# EasyEDA Pro project TF_MUX.epro, schematic TF_MUX v0.0.5-RC1
Board Name: TF_MUX; Create Date: 2025-04-12; Page Name: main; Project Name: sd_mux; Schematic Name: TF_MUX v0.0.5-RC1; Update Date: 2025-04-29; Company: @Rath @LingWang; Drawed: LingWang; Page Size: A4; Reviewed: Rath; Version: V0.0.5-RC1
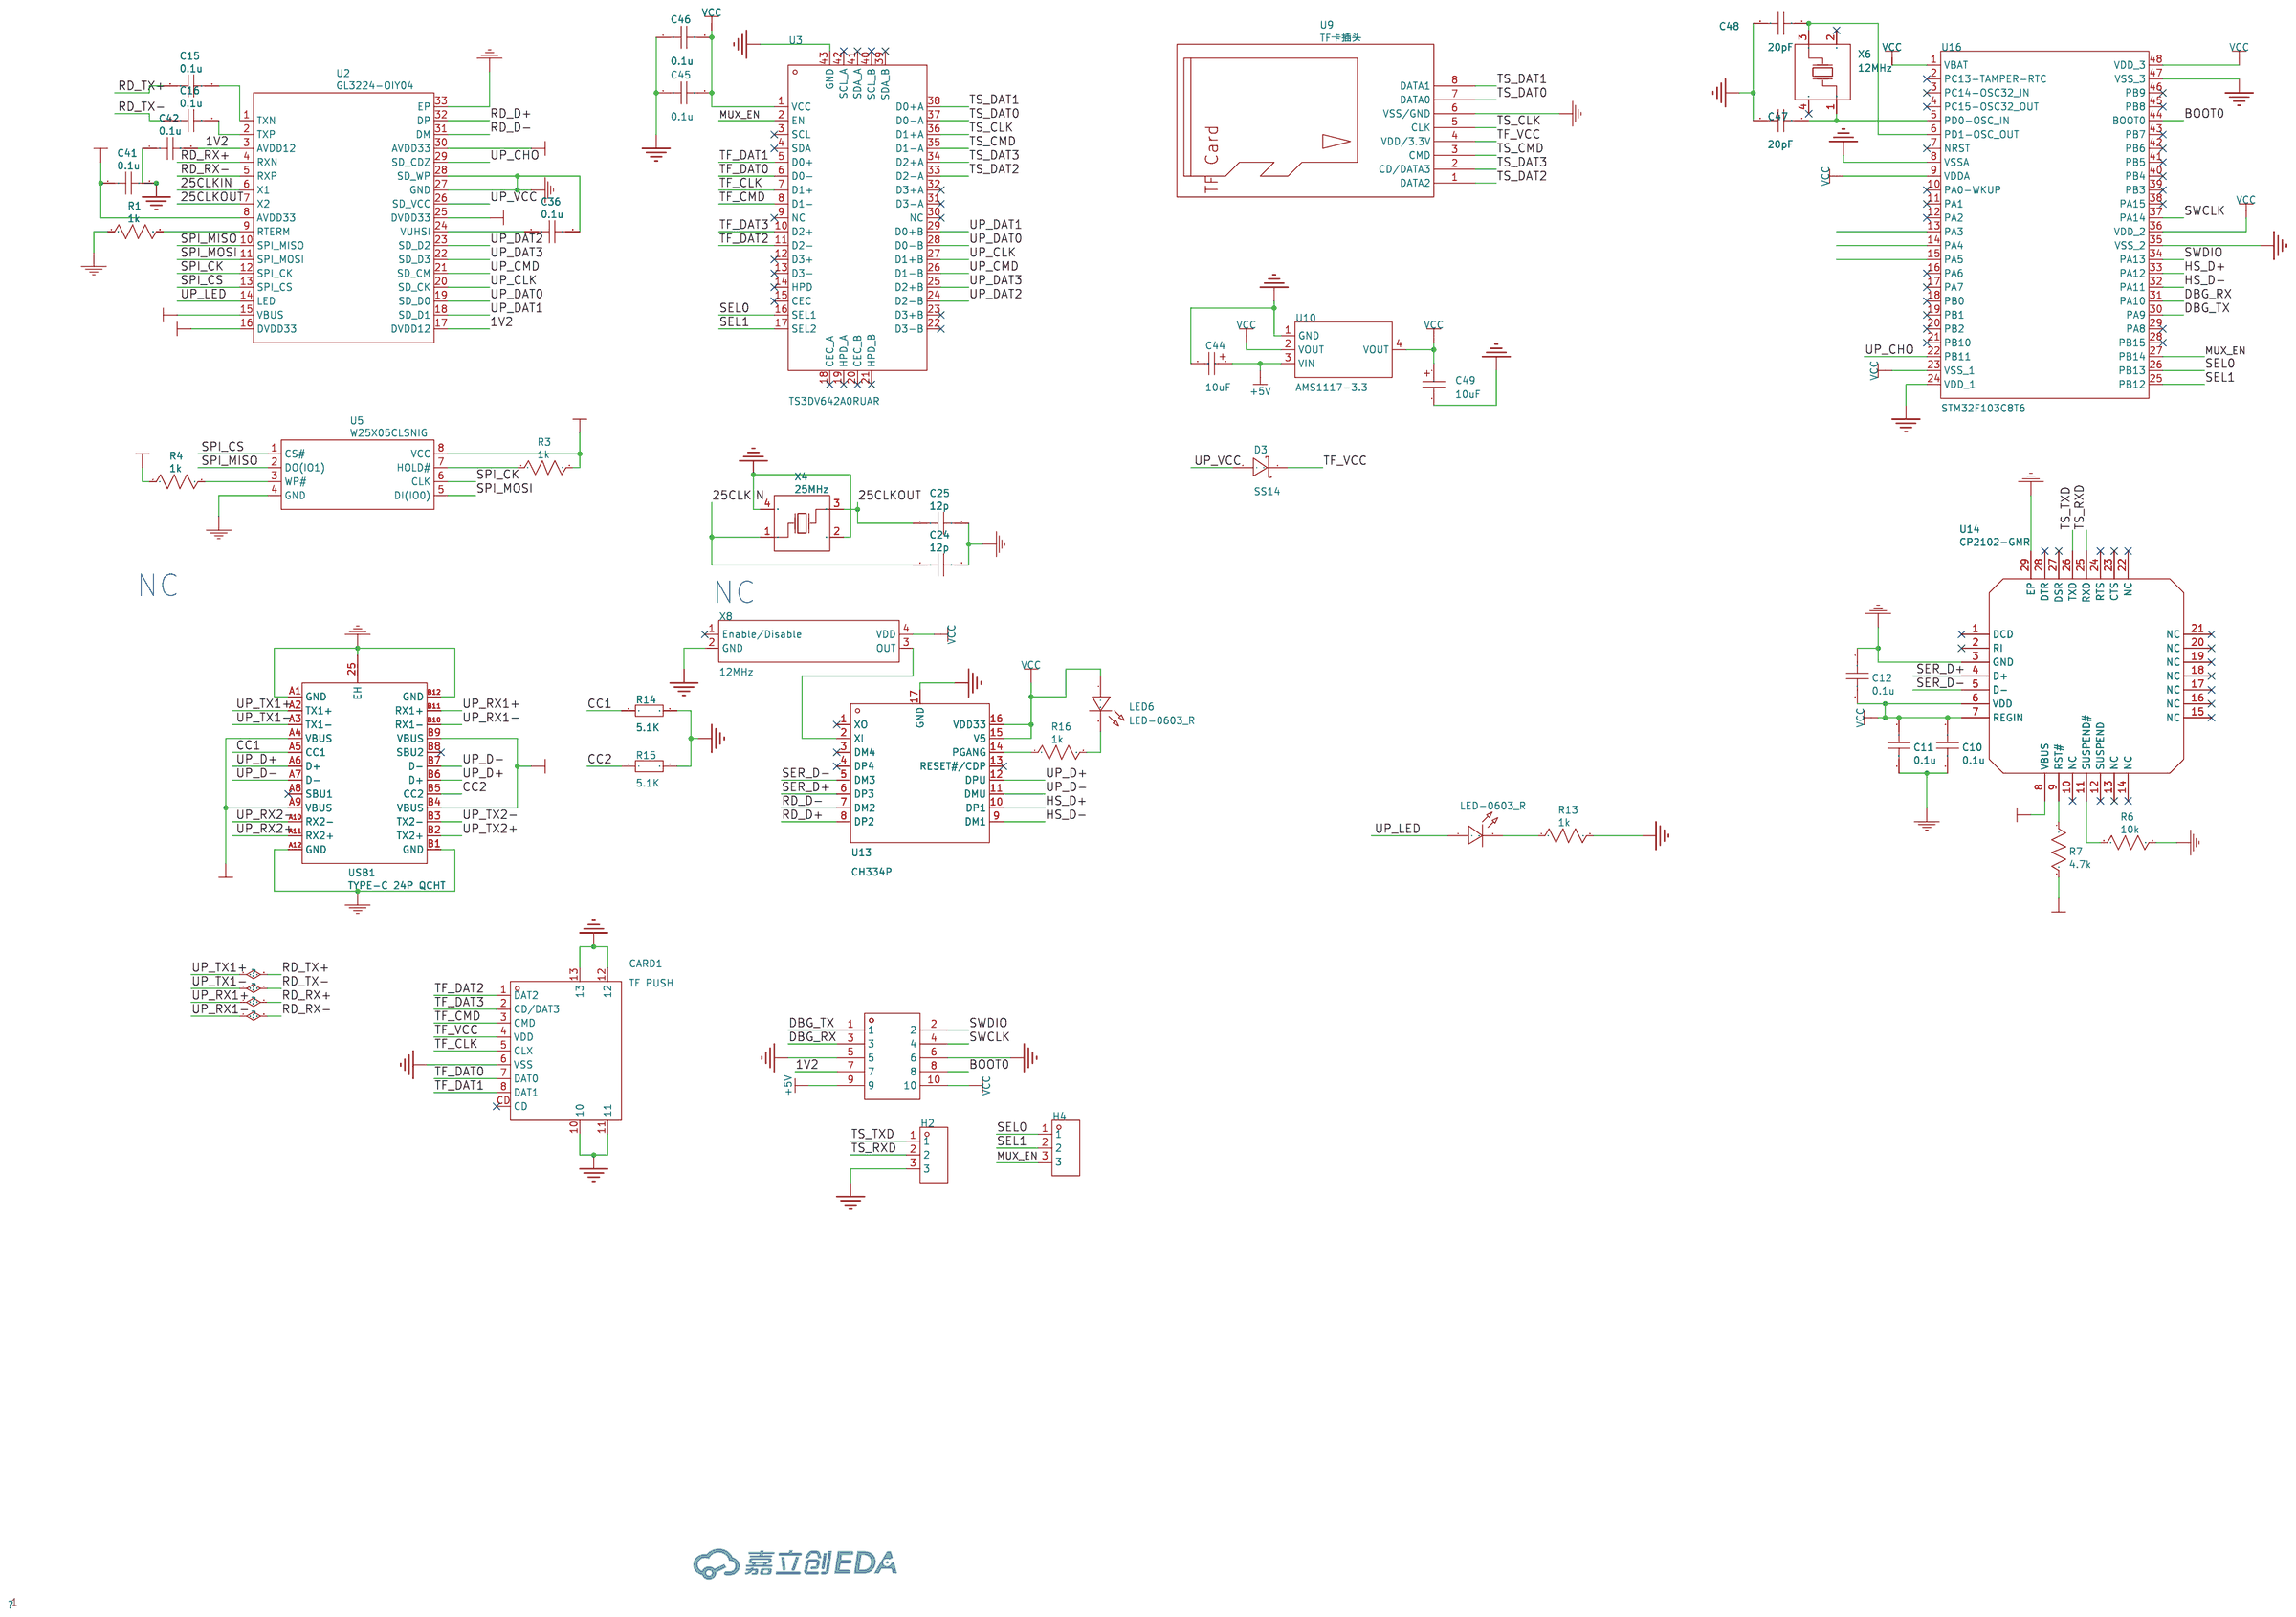
[diagram p0: schematic sheet]

## Parts
C10  0.1u  [C0402]  (no BOM)
C11  0.1u  [C0402]  (no BOM)
C12  0.1u  [C0402]  (no BOM)
C15  0.1u  [C0402]
C16  0.1u  [C0402]
C24  12p  [C0603]  (no BOM)
C25  12p  [C0603]  (no BOM)
C36  0.1u  [C0402]
C41  0.1u  [C0402]
C42  0.1u  [C0402]
C44  10uF  [CAP-SMD_L3.2-W1.6-RD-C7171]
C45  0.1u  [C0402]
C46  0.1u  [C0402]
C47  20pF  [C0402]
C48  20pF  [C0402]
C49  10uF  [CAP-SMD_L3.2-W1.6-RD-C7171]
CARD1  TF PUSH  [TF-SMD_TF-PUSH]
D3  SS14  [SMA_L4.2-W2.6-LS5.3-RD]
H2  -  [HDR-TH_3P-P2.54-V-M]
H3  -  [HDR-TH_10P-P2.54-V-M-R2-C5-S2.54]
H4  -  [HDR-TH_3P-P2.54-V-M]
LED5  LED-0603_R  [LED0603_RED]
LED6  LED-0603_R  [LED0603_RED]
R1  1k  [R0603]
R3  1k  [R0603]  (no BOM)
R4  1k  [R0603]  (no BOM)
R6  10k  [R0603]  (no BOM)
R7  4.7k  [R0603]  (no BOM)
R13  1k  [R0603]
R14  5.1K  [R0603]
R15  5.1K  [R0603]
R16  1k  [R0603]
U2  GL3224-OIY04  [HQFN-32_L5.0-W5.0-P0.50-BL-EP3.0]
U3  TS3DV642A0RUAR  [WFQFN-42_L9.0-W3.5-P0.50-BL-EP]
U5  W25X05CLSNIG  [SOIC-8_L4.9-W3.9-P1.27-LS6.0-BL]  (no BOM)
U9  TF卡插头  [TF卡封装]  (no BOM)
U10  AMS1117-3.3  [SOT-223-3_L6.5-W3.4-P2.30-LS7.0-BR]
U13  CH334P  [QFN-16_L3.0-W3.0-P0.50-BL-EP1.7]
U14  CP2102-GMR  [WQFN-28_L5.0-W5.0-P0.50-BL-EP3.2]  (no BOM)
U16  STM32F103C8T6  [LQFP-48_L7.0-W7.0-P0.50-LS9.0-BL]
USB1  TYPE-C 24P QCHT  [TYPE-C-SMD_TYPE-C-24P-QCHT]
X4  25MHz  [CRYSTAL-SMD_4P-L3.2-W2.5-BL]  (no BOM)
X6  12MHz  [CRYSTAL-SMD_4P-L3.2-W2.5-BL]
X8  12MHz  [OSC-SMD_4P-L2.0-W1.6-BL]  (no BOM)

## Library data of the parts
C10-C12 C15 C16 C36 C41 C42 C45 C46 = 0.1u
C24 C25 = 12p
C44 C49 = TAJA106K016RNJ: 容值:10uF;精度:±10%;额定电压:16V;等效串联电阻:3Ω@100kHz;; LCSC Part Name: 10uF ±10% 16V; Supplier Part: C7171; Manufacturer: Kyocera AVX; Supplier Footprint: CASE-A-3216; JLCPCB Part Class: 基础库; Datasheet: https://atta.szlcsc.com/upload/public/pdf/source/20160107/1457707750344.pdf; Supplier: LCSC; Tolerance: ±10%; Rated Voltage: 16V; Equivalent Series Resistance(ESR): 3Ω@100kHz; Operating Temperature: -55℃~+125℃
C47 C48 = CAP_0402: Supplier Footprint: 0402
CARD1 = TF PUSH: 卡连接方式:自弹式;卡类型:MicroSD卡(TF卡);连接器类型:卡座;本体最大高度:2mm;工作温度范围:-20℃~+90℃;; LCSC Part Name: 自弹式 MicroSD卡(TF卡) 卡座; Supplier Part: C393941; Manufacturer: SHOU HAN(首韩); Supplier Footprint: SMD; JLCPCB Part Class: 扩展库; Datasheet: https://atta.szlcsc.com/upload/public/pdf/source/20191011/C393941_0DDD896EE907FEB750D8B7B8982E2A67.pdf; Supplier: LCSC; Card Connection Mode: 自弹式; Card Type: MicroSD卡(TF卡); Connector Type: 卡座; Additional Card Detection Pins: 无; Maximum Body Height: 2mm; Operating Temperature Range: -20℃~+90℃
D3 = SS14_C2480: 二极管配置:独立式;正向压降(Vf):550mV@1A;直流反向耐压(Vr):40V;整流电流:1A;; LCSC Part Name: 电压:40V 电流:1A; Supplier Part: C2480; Manufacturer: MDD(辰达半导体); Supplier Footprint: SMA(DO-214AC); JLCPCB Part Class: 基础库; Datasheet: https://atta.szlcsc.com/upload/public/pdf/source/20240710/EF24798823EE33D63F154ED67BAC5E71.pdf; Supplier: LCSC; Diode Configuration: 独立式; Forward Voltage (Vf@If): 550mV@1A; Reverse Voltage (Vr): 40V; Rectified Current: 1A; Reverse Leakage Current (Ir): 300uA@40V
H2 H4 = HDR-M_2.54_1x3P: Supplier Part: C2937625; Supplier Footprint: 插件
H3 = HDR-M_2.54_2x5: Supplier Part: C124387; Supplier Footprint: 插件,P=2.54mm
LED5 LED6 = LED-0603_R: Manufacturer: EVERLIGHT(台湾亿光); Manufacturer Part: 19-217/R6C-AL1M2VY/3T; Supplier Part: C72044; Supplier: LCSC
R1 R3 R4 R13 R16 = 1k
R6 = 10k
R7 = 4.7k
R14 R15 = Res_0603: Supplier Footprint: 0603
U2 = GL3224-OIY04: Supplier: LCSC; Supplier Part: C157357; Manufacturer: GENESYS(创惟); JLCPCB Part Class: Extended Part
U3 = TS3DV642A0RUAR: 开关电路:单刀双掷(SPDT);通道数:12;导通电阻(Ron@VCC):9.5Ω;; LCSC Part Name: 具有1.8V兼容控制和断电模式的12通道1:2多路复用器/多路解复用器; Supplier Part: C157482; Manufacturer: TI(德州仪器); Supplier Footprint: WFQFN-42-EP(3.5x9); JLCPCB Part Class: 扩展库; Datasheet: https://www.ti.com/cn/lit/gpn/ts3dv642; Supplier: LCSC; Switch Circuit: 单刀双掷(SPDT); Number of Channels: 12; Supply Voltage: 2.6V~4.5V; Turn-on time: 100ns; On-State Resistance (Max): 9.5Ω; Operating Temperature: -40℃~+85℃
U5 = W25X05CLSNIG: Supplier: LCSC; Supplier Part: C2641187; Manufacturer: WINBOND(华邦); JLCPCB Part Class: Extended Part
U9 = TF卡插头: Supplier: HeZo
U10 = AMS1117-3.3_C6186: 输出类型:固定;工作电压:-;输出电压:3.3V;输出电流:1A;电源纹波抑制比(PSRR):72dB@(120Hz);输出极性:正极;; LCSC Part Name: 输出3.3V 1A; Supplier Part: C6186; Manufacturer: AMS; Supplier Footprint: SOT-223; JLCPCB Part Class: 基础库; Datasheet: https://atta.szlcsc.com/upload/public/pdf/source/20180727/C6186_7A095716F0823C02F1997A905E26C086.pdf; Supplier: LCSC; Output Type: 固定; Output Voltage: 3.3V; Output Current: 1A; Power Supply Rejection Ratio (PSRR): 72dB@(120Hz); Voltage Dropout: 1.3V@(800mA); Features: 过流保护(OCP)；热关断(TSD); Output Configuration: 正极; Number of Outputs: 1
U13 = CH334P: CH334和CH335是符合USB2.0协议规范的4端口USBHUB控制器芯片，上行端口支持USB2.0高速和全速，下行端口支持USB2.0高速480Mbps、全速12Mbps和低速1.5Mbps。; Supplier Part: C5373042; Manufacturer: WCH(南京沁恒); Supplier Footprint: QFN-16(3x3); JLCPCB Part Class: 扩展库; Datasheet: https://atta.szlcsc.com/upload/public/pdf/source/20230505/F9D05933C283E82A0686C9413889129E.pdf; Supplier: LCSC; type: 集线器; Protocol: USB 2.0; Data Rate: 480Mbps; Supply Voltage: 3.3V; Operating Temperature: -40℃~+85℃
U14 = CP2102-GMR: Supplier: LCSC; Manufacturer: SKYWORKS/SILICON LABS(芯科); Supplier Part: C6568; JLCPCB Part Class: Extended Part
U16 = STM32F103C8T6: CPU内核:ARM-M3;CPU最大主频:72MHz;应用领域:-;; LCSC Part Name: 主流增强型ARM Cortex-M3 MCU，具有64 KB Flash、72 MHz CPU、电机控制、USB和CAN; Supplier Part: C8734; Manufacturer: ST(意法半导体); Supplier Footprint: LQFP-48(7x7); JLCPCB Part Class: 扩展库; Datasheet: https://atta.szlcsc.com/upload/public/pdf/source/20220812/8363ACEC51AD55ECEB84799464F7CB85.pdf; Supplier: LCSC; CPU Core: ARM-M3; CPU Maximum Speed: 72MHz; Program Storage Size: 64KB; Program Memory Type: FLASH; Number of I/O: 37; ADC (Bit): 12bit; Low Voltage Detection Threshold: 2V~3.6V
USB1 = TYPE-C 24P QCHT: Supplier: LCSC; Supplier Part: C456013; Manufacturer: SHOU HAN(首韩); JLCPCB Part Class: Extended Part
X4 = 25MHz: Supplier: LCSC; Manufacturer: YXC(扬兴晶振); Manufacturer Part: X322525MOB4SI; Supplier Part: C9006; JLCPCB Part Class: Basic Part
X6 = X322512MSB4SI: 晶振类型:贴片晶振;频率:12MHz;常温频差:±10ppm;外接负载电容:20pF;频率稳定度(全温):±20ppm;; LCSC Part Name: 12MHz ±10ppm 20pF; Supplier Part: C9002; Manufacturer: YXC(扬兴晶振); Supplier Footprint: SMD3225-4P; JLCPCB Part Class: 基础库; Datasheet: https://atta.szlcsc.com/upload/public/pdf/source/20240329/19D5F850207469550BEB00D7DFEDBC7A.pdf; Supplier: LCSC; Crystal Type: 贴片晶振; Normal temperature Frequency Tolerance: ±10ppm; External load capacitor: 20pF; Frequency Stability(Full temperature range): ±20ppm; Operating Temperature: -40℃~+85℃
X8 = OT201612MJBA4SL: 频率:12MHz;常温频差:±10ppm;输出模式:CMOS;工作电压:1.8V~3.3V;工作电流:4mA;频率稳定度:±20ppm;; LCSC Part Name: 12MHz ±10ppm 1.8V~3.3V YSO110TR; Supplier Part: C669076; Manufacturer: YXC(扬兴晶振); Supplier Footprint: SMD2016-4P; JLCPCB Part Class: 扩展库; Datasheet: https://atta.szlcsc.com/upload/public/pdf/source/20240731/596E5F7673E50DA744B7F79F139FB8DF.pdf; Supplier: LCSC; Normal temperature Frequency Tolerance: ±10ppm; Output Type: CMOS; Voltage - Supply: 1.8V~3.3V; Current - Supply: 4mA; Frequency Stability: ±20ppm; Operating Temperature: -40℃~+85℃

## Nets
1V2: C42.2 H3.7 U2.3(AVDD12) U2.17(DVDD12)
+5V: C44.1 H3.9 U2.15(VBUS) U10.3(VIN) U14.8(VBUS) USB1.A4(VBUS) USB1.A9(VBUS) USB1.B4(VBUS) USB1.B9(VBUS)
GND: C10.2 C11.2 C12.1 C24.2 C25.2 C36.2 C41.2 C42.1 C44.2 C45.1 C46.1 C47.2 C48.2 C49.2 CARD1.6(VSS) CARD1.10 CARD1.11 CARD1.12 CARD1.13 H2.3 H3.5 H3.6 R1.1 R6.1 R13.2 R14.2 R15.2 U2.27(GND) U2.28(SD_WP) U2.33(EP) U3.43(GND) U5.4(GND) U9.6(VSS/GND) U10.1(GND) U13.17(GND) U14.3(GND) U14.29(EP) U16.8(VSSA) U16.24(VDD_1) U16.35(VSS_2) U16.47(VSS_3) USB1.25(EH) USB1.A1(GND) USB1.A12(GND) USB1.B1(GND) USB1.B12(GND) X4.2(GND) X4.4(GND) X8.2(GND)
VCC: C10.1 C11.1 C12.2 C41.1 C45.2 C46.2 C49.1 H3.10 LED6.1 R3.2 R4.1 R7.2 U2.8(AVDD33) U2.16(DVDD33) U2.25(DVDD33) U2.30(AVDD33) U3.1(VCC) U5.8(VCC) U10.2(VOUT) U10.4(VOUT) U13.15(V5) U13.16(VDD33) U14.6(VDD) U14.7(REGIN) U16.1(VBAT) U16.9(VDDA) U16.23(VSS_1) U16.36(VDD_2) U16.48(VDD_3) X8.4(VDD)
25CLKIN: C24.1 U2.6(X1) X4.1(OSC1)
25CLKOUT: C25.1 U2.7(X2) X4.3(OSC2)
BOOT0: H3.8 U16.44(BOOT0)
CC1: R14.1 USB1.A5(CC1)
CC2: R15.1 USB1.B5(CC2)
DBG_RX: H3.3 U16.31(PA10)
DBG_TX: H3.1 U16.30(PA9)
HS_D+: U13.10(DP1) U16.33(PA12)
HS_D-: U13.9(DM1) U16.32(PA11)
MUX_EN: H4.3 U3.2(EN) U16.27(PB14)
RD_D+: U2.32(DP) U13.8(DP2)
RD_D-: U2.31(DM) U13.7(DM2)
RD_RX+: U2.4(RXN) USB1.B11(RX1+)
RD_RX-: U2.5(RXP) USB1.B10(RX1-)
RD_TX+: C15.1 USB1.A2(TX1+)
RD_TX-: C16.1 USB1.A3(TX1-)
SEL0: H4.1 U3.16(SEL1) U16.26(PB13)
SEL1: H4.2 U3.17(SEL2) U16.25(PB12)
SER_D+: U13.6(DP3) U14.4(D+)
SER_D-: U13.5(DM3) U14.5(D-)
SPI_CK: U2.12(SPI_CK) U5.6(CLK)
SPI_CS: U2.13(SPI_CS) U5.1(CS#)
SPI_MISO: U2.10(SPI_MISO) U5.2(DO(IO1))
SPI_MOSI: U2.11(SPI_MOSI) U5.5(DI(IO0))
SWCLK: H3.4 U16.37(PA14)
SWDIO: H3.2 U16.34(PA13)
TF_CLK: CARD1.5(CLX) U3.7(D1+)
TF_CMD: CARD1.3(CMD) U3.8(D1-)
TF_DAT0: CARD1.7(DAT0) U3.6(D0-)
TF_DAT1: CARD1.8(DAT1) U3.5(D0+)
TF_DAT2: CARD1.1(DAT2) U3.11(D2-)
TF_DAT3: CARD1.2(CD/DAT3) U3.10(D2+)
TF_VCC: CARD1.4(VDD) D3.1(K) U9.4(VDD/3.3V)
TS_CLK: U3.36(D1+A) U9.5(CLK)
TS_CMD: U3.35(D1-A) U9.3(CMD)
TS_DAT0: U3.37(D0-A) U9.7(DATA0)
TS_DAT1: U3.38(D0+A) U9.8(DATA1)
TS_DAT2: U3.33(D2-A) U9.1(DATA2)
TS_DAT3: U3.34(D2+A) U9.2(CD/DATA3)
TS_RXD: H2.2 U14.25(RXD)
TS_TXD: H2.1 U14.26(TXD)
UP_CHO: U2.29(SD_CDZ) U16.22(PB11)
UP_CLK: U2.20(SD_CK) U3.27(D1+B)
UP_CMD: U2.21(SD_CM) U3.26(D1-B)
UP_D+: U13.12(DPU) USB1.A6(D+) USB1.B6(D+)
UP_D-: U13.11(DMU) USB1.A7(D-) USB1.B7(D-)
UP_DAT0: U2.19(SD_D0) U3.28(D0-B)
UP_DAT1: U2.18(SD_D1) U3.29(D0+B)
UP_DAT2: U2.23(SD_D2) U3.24(D2-B)
UP_DAT3: U2.22(SD_D3) U3.25(D2+B)
UP_LED: LED5.1 U2.14(LED)
UP_RX2+: USB1.A11(RX2+)
UP_RX2-: USB1.A10(RX2-)
UP_TX2+: USB1.B2(TX2+)
UP_TX2-: USB1.B3(TX2-)
UP_VCC: D3.2(A) U2.26(SD_VCC)
$1N442: R1.2 U2.9(RTERM)
$1N465: C16.2 U2.2(TXP)
$1N466: C15.2 U2.1(TXN)
$1N469: C36.1 U2.24(VUHSI)
$1N1150: LED5.2 R13.1
$1N2251: R3.1 U5.7(HOLD#)
$1N2254: R4.2 U5.3(WP#)
$1N4322: U13.2(XI) X8.3(OUT)
$1N4433: LED6.2 R16.2
$1N4439: R16.1 U13.14(PGANG)
$1N5720: R6.2 U14.11(SUSPEND#)
$1N5721: R7.1 U14.9(RST#)
$1N8737: C48.1 U16.6(PD1-OSC_OUT) X6.3(OSC2)
$1N8742: C47.1 U16.5(PD0-OSC_IN) X6.1(OSC1)

Not connected (* = marked no-connect by the designer): CARD1 CD*; U3 3(SCL)* 4(SDA)* 9(NC)* 12(D3+)* 13(D3-)* 14(HPD)* 15(CEC)* 18(CEC_A)* 19(HPD_A)* 20(CEC_B)* 21(HPD_B)* 22(D3-B)* 23(D3+B)* 30(NC)* 31(D3-A)* 32(D3+A)* 39(SDA_B)* 40(SCL_B)* 41(SDA_A)* 42(SCL_A)*; U13 1(XO)* 3(DM4)* 4(DP4)* 13(RESET#/CDP)*; U14 1(DCD)* 2(RI)* 10(NC)* 12(SUSPEND)* 13(NC)* 14(NC)* 15(NC)* 16(NC)* 17(NC)* 18(NC)* 19(NC)* 20(NC)* 21(NC)* 22(NC)* 23(CTS)* 24(RTS)* 27(DSR)* 28(DTR)*; U16 2(PC13-TAMPER-RTC)* 3(PC14-OSC32_IN)* 4(PC15-OSC32_OUT)* 7(NRST)* 10(PA0-WKUP)* 11(PA1)* 12(PA2)* 13(PA3) 14(PA4) 15(PA5) 16(PA6)* 17(PA7)* 18(PB0)* 19(PB1)* 20(PB2)* 21(PB10)* 28(PB15)* 29(PA8)* 38(PA15)* 39(PB3)* 40(PB4)* 41(PB5)* 42(PB6)* 43(PB7)* 45(PB8)* 46(PB9)*; USB1 A8(SBU1)* B8(SBU2)*; X6 2(GND)* 4(GND)*; X8 1(Enable/Disable)*

## Notes on the sheet
- NC
- NC
